# EAGLE design ROV_PWR_4inch (EAGLE 9.2.2)
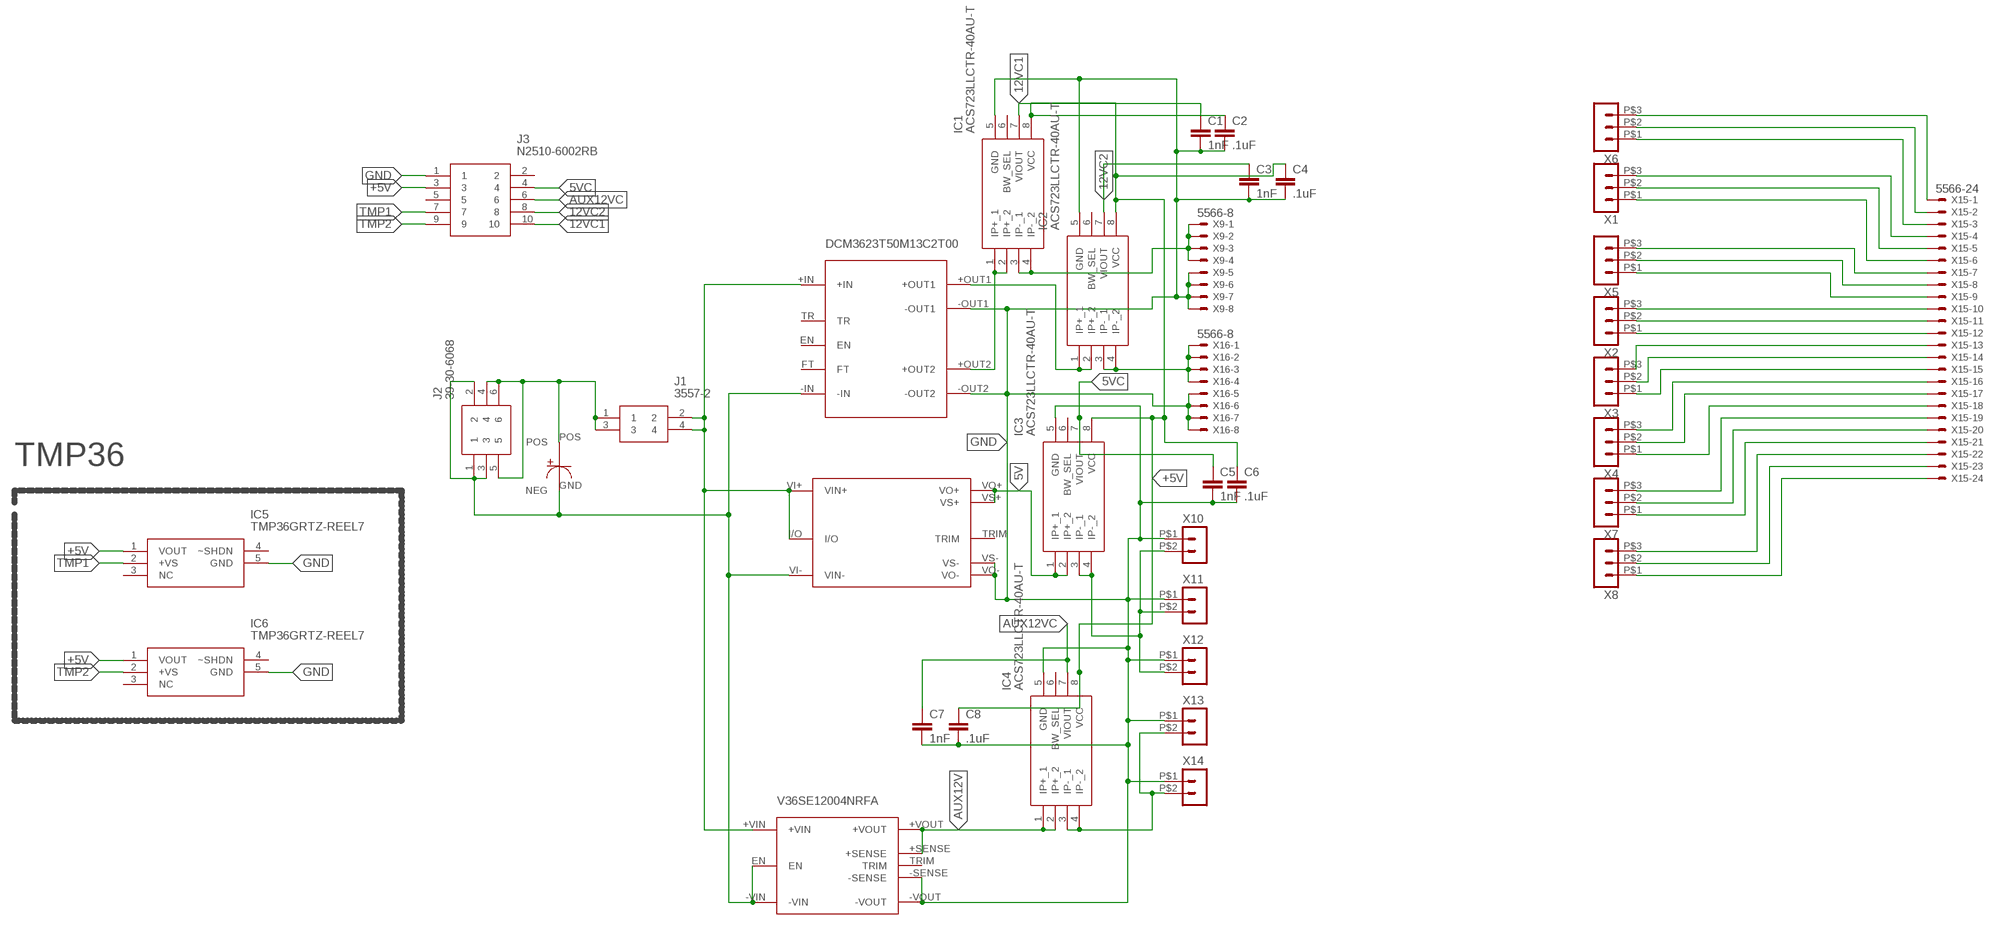
[diagram p0: schematic, sheet 1]

## Parts
C1  1nF  C-EUC0402  [C0402]
C2  .1uF  C-EUC0402  [C0402]
C3  1nF  C-EUC0402  [C0402]
C4  .1uF  C-EUC0402  [C0402]
C5  1nF  C-EUC0402  [C0402]
C6  .1uF  C-EUC0402  [C0402]
C7  1nF  C-EUC0402  [C0402]
C8  .1uF  C-EUC0402  [C0402]
IC1  ACS723LLCTR-40AU-T  [SOT127P600X175-8N]
IC2  ACS723LLCTR-40AU-T  [SOT127P600X175-8N]
IC3  ACS723LLCTR-40AU-T  [SOT127P600X175-8N]
IC4  ACS723LLCTR-40AU-T  [SOT127P600X175-8N]
IC5  TMP36GRTZ-REEL7  [SOT95P280X145-5N]
IC6  TMP36GRTZ-REEL7  [SOT95P280X145-5N]
J1  3557-2  [3557-2]
J2  39-30-6068  [39306068]
J3  N2510-6002RB  [SHDR10W64P254_2X5_2002X859X100]
U$1  DCM3623T50M13C2T00  [DCM3623T50M13C2T00]
U$2  KHHD006A0A41Z  [KHHD006A0A41Z]
U$3  V36SE12004NRFA  [V36SE12004NRFA]
U$4  UBY1V222MHL  [UBY1V222MHL]
X1  HEADER_POS3_43650-0315  [43650-0315]
X2  HEADER_POS3_43650-0315  [43650-0315]
X3  HEADER_POS3_43650-0315  [43650-0315]
X4  HEADER_POS3_43650-0315  [43650-0315]
X5  HEADER_POS3_43650-0315  [43650-0315]
X6  HEADER_POS3_43650-0315  [43650-0315]
X7  HEADER_POS3_43650-0315  [43650-0315]
X8  HEADER_POS3_43650-0315  [43650-0315]
X9  5566-8  [5566-8]
X10  HEADER_POS2_44914-0201  [44914-0201]
X11  HEADER_POS2_44914-0201  [44914-0201]
X12  HEADER_POS2_44914-0201  [44914-0201]
X13  HEADER_POS2_44914-0201  [44914-0201]
X14  HEADER_POS2_44914-0201  [44914-0201]
X15  5566-24  [5566-24]
X16  5566-8  [5566-8]

## Nets
5V: IC3.1(IP+_1) IC3.2(IP+_2) U$2.VO+ U$2.VS+
5VC: C5.1 IC3.7(VIOUT) J3.4
12VC1: C1.1 IC1.7(VIOUT) J3.10
12VC2: C3.1 IC2.7(VIOUT) J3.8
+5V: C2.1 C4.1 C6.1 C8.1 IC1.8(VCC) IC2.8(VCC) IC3.8(VCC) IC4.8(VCC) IC5.1(VOUT) IC6.1(VOUT) J3.3
AUX12V: IC4.1(IP+_1) IC4.2(IP+_2) U$3.+SENSE U$3.+VOUT
AUX12VC: C7.1 IC4.7(VIOUT) J3.6
GND: C1.2 C2.2 C3.2 C4.2 C5.2 C6.2 C7.2 C8.2 IC1.5(GND) IC2.5(GND) IC3.5(GND) IC4.5(GND) IC5.5(GND) IC6.5(GND) J3.1 U$1.-OUT1 U$1.-OUT2 U$2.VO- U$2.VS- U$3.-SENSE U$3.-VOUT X9.5 X9.6 X9.7 X9.8 X10.P$1 X11.P$1 X12.P$1 X13.P$1 X14.P$1 X16.5 X16.6 X16.7 X16.8
N$1: X6.P$3 X15.1
N$2: X6.P$2 X15.2
N$3: X6.P$1 X15.3
N$4: X1.P$3 X15.4
N$5: X1.P$2 X15.5
N$6: X1.P$1 X15.6
N$7: X5.P$3 X15.7
N$8: X5.P$2 X15.8
N$9: X5.P$1 X15.9
N$10: X2.P$3 X15.10
N$11: X2.P$2 X15.11
N$12: X2.P$1 X15.12
N$13: X3.P$3 X15.13
N$14: X3.P$2 X15.14
N$15: X3.P$1 X15.15
N$16: X4.P$3 X15.16
N$17: X4.P$2 X15.17
N$18: X4.P$1 X15.18
N$19: X7.P$3 X15.19
N$20: X7.P$2 X15.20
N$21: X7.P$1 X15.21
N$22: X8.P$3 X15.22
N$23: X8.P$2 X15.23
N$24: X8.P$1 X15.24
N$26: J1.2 J1.4 U$1.+IN U$2.I/O U$2.VI+(VIN+) U$3.+VIN
N$27: IC1.1(IP+_1) IC1.2(IP+_2) U$1.+OUT2
N$28: J2.1 J2.2 J2.3 U$1.-IN U$2.VI-(VIN-) U$3.-VIN U$3.EN U$4.GND(NEG)
N$29: J1.1 J1.3 J2.4 J2.5 J2.6 U$4.POS
N$30: IC3.3(IP-_1) IC3.4(IP-_2) X10.P$2 X11.P$2 X12.P$2
N$31: IC4.3(IP-_1) IC4.4(IP-_2) X13.P$2 X14.P$2
N$32: IC2.1(IP+_1) IC2.2(IP+_2) U$1.+OUT1
N$33: IC2.3(IP-_1) IC2.4(IP-_2) X16.1 X16.2 X16.3 X16.4
N$34: IC1.3(IP-_1) IC1.4(IP-_2) X9.1 X9.2 X9.3 X9.4
TMP1: IC5.2(+VS) J3.7
TMP2: IC6.2(+VS) J3.9
Unconnected: IC1.6(BW_SEL) IC2.6(BW_SEL) IC3.6(BW_SEL) IC4.6(BW_SEL) IC5.3(NC) IC5.4(~SHDN) IC6.3(NC) IC6.4(~SHDN) J3.2 J3.5 U$1.EN U$1.FT U$1.TR U$2.TRIM U$3.TRIM

## Notes on the sheet
- TMP36

## Library data of the parts
C1-C8 = rcl:C-EU: CAPACITOR, European symbol; SPICEPREFIX: C
IC1-IC4 = SamacSys_Parts:ACS723LLCTR-40AU-T: SENSOR CURRENT HALL 40A DC Source: Datasheet <http://www.allegromicro.com/~/media/Files/Datasheets/ACS723-Datasheet.ashx>; DESCRIPTION: SENSOR CURRENT HALL 40A DC; HEIGHT: 1.75mm; MANUFACTURER_NAME: Allegro Microsystems; MANUFACTURER_PART_NUMBER: ACS723LLCTR-40AU-T
IC5 IC6 = SamacSys_Parts:TMP36GRTZ-REEL7: Analog Devices TMP36GRTZ-REEL7 Temperature Sensor 5-Pin SOT-23, -40 +125 C Source: Datasheet <https://componentsearchengine.com/Datasheets/1/TMP36GRTZ-REEL7.pdf>; DESCRIPTION: Analog Devices TMP36GRTZ-REEL7 Temperature Sensor 5-Pin SOT-23, -40 +125 C; HEIGHT: mm; MANUFACTURER_NAME: Analog Devices; MANUFACTURER_PART_NUMBER: TMP36GRTZ-REEL7; MOUSER_PART_NUMBER: 584-TMP36GRTZ-R7
J1 = SamacSys_Parts:3557-2: THM 2 in 1 Auto Blade Holder P/N 3557-2 Source: Datasheet <https://componentsearchengine.com/Datasheets/1/3557-2.pdf>; DESCRIPTION: THM 2 in 1 Auto Blade Holder P/N 3557-2; HEIGHT: mm; MANUFACTURER_NAME: Keystone Electronics; MANUFACTURER_PART_NUMBER: 3557-2; MOUSER_PART_NUMBER: 534-3557-2
J2 = SamacSys_Parts:39-30-6068: Headers & Wire Housings MiniFit Vert Hdr Ass Assy 6Ckt 94V-0 Tin Source: Datasheet <https://componentsearchengine.com/Datasheets/1/39-30-6068.pdf>; DESCRIPTION: Headers & Wire Housings MiniFit Vert Hdr Ass Assy 6Ckt 94V-0 Tin; HEIGHT: 12.8mm; MANUFACTURER_NAME: Molex; MANUFACTURER_PART_NUMBER: 39-30-6068; MOUSER_PART_NUMBER: 538-39-30-6068
J3 = SamacSys_Parts:N2510-6002RB: 3M 10W ST BOX HDR CLASS 2 3M 2500 Series, 2.54mm Pitch 10 Way 2 Row Straight PCB Header, Solder Termination, 2A Source: Datasheet <https://componentsearchengine.com/Datasheets/1/N2510-6002RB.pdf>; DESCRIPTION: 3M 10W ST BOX HDR CLASS 2 3M 2500 Series, 2.54mm Pitch 10 Way 2 Row Straight PCB Header, Solder Termination, 2A; HEIGHT: 10.04mm; MANUFACTURER_NAME: 3M; MANUFACTURER_PART_NUMBER: N2510-6002RB; MOUSER_PART_NUMBER: 517-N2510-6002RB
U$1 = DCM3623T50M13C2T00:DCM3623T50M13C2T00
U$2 = KHHD006A0A41Z:KHHD006A0A41Z
U$3 = V36SE12004NRFA:V36SE12004NRFA
U$4 = UBY1V222MHL:UBY1V222MHL
X1-X8 = con-molex-micro-fit-3_0:HEADER_POS3_?: Molex - Micro-Fit 3.0 Series connector, 3.00mm (0.118") pitch header, 3 positions.
X9 X16 = con-molex:5566-8: Mini FIT connector 8 pol Source: http://www.molex.com; MF: MOLEX; OC_FARNELL: unknown; OC_NEWARK: unknown
X10-X14 = con-molex-micro-fit-3_0:HEADER_POS2_?: Molex - Micro-Fit 3.0 Series connector, 3.00mm (0.118") pitch header, 2 positions.
X15 = con-molex:5566-24: Mini FIT connector 24 pol Source: http://www.molex.com; MF: MOLEX; OC_FARNELL: unknown; OC_NEWARK: unknown

## Board
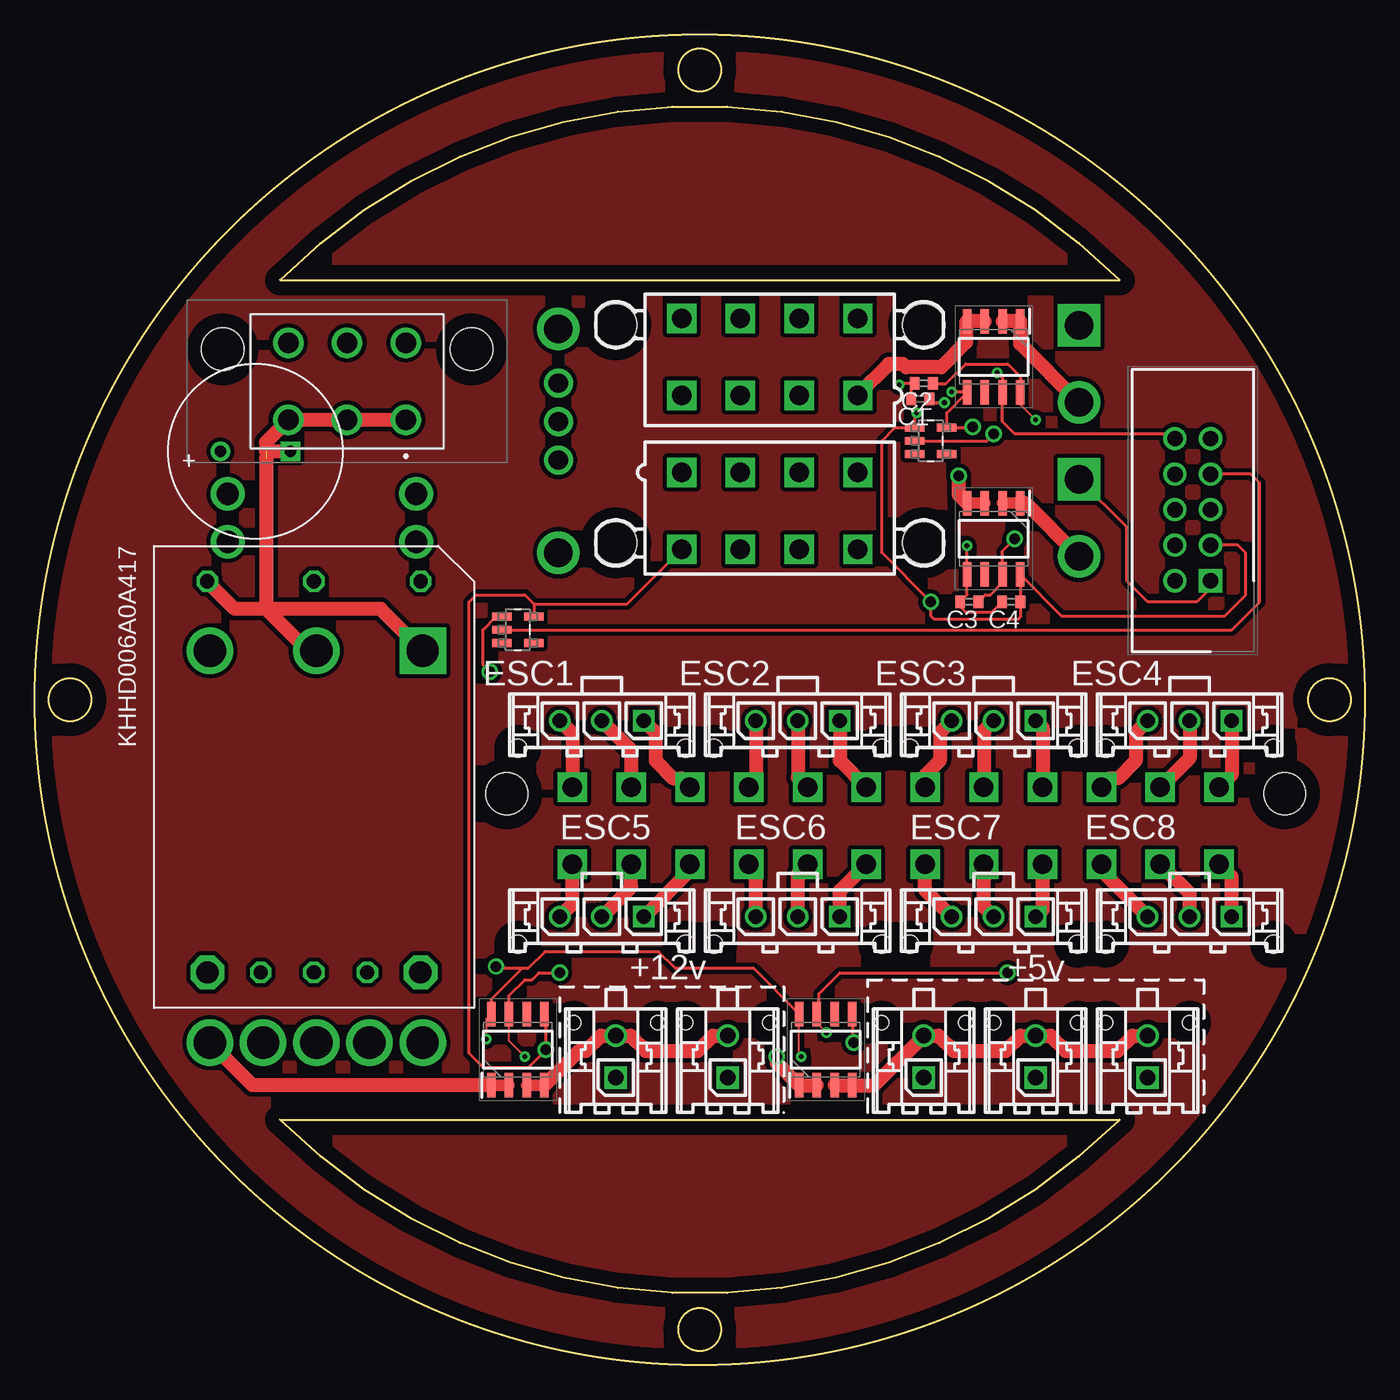
[diagram p1: board, top side]
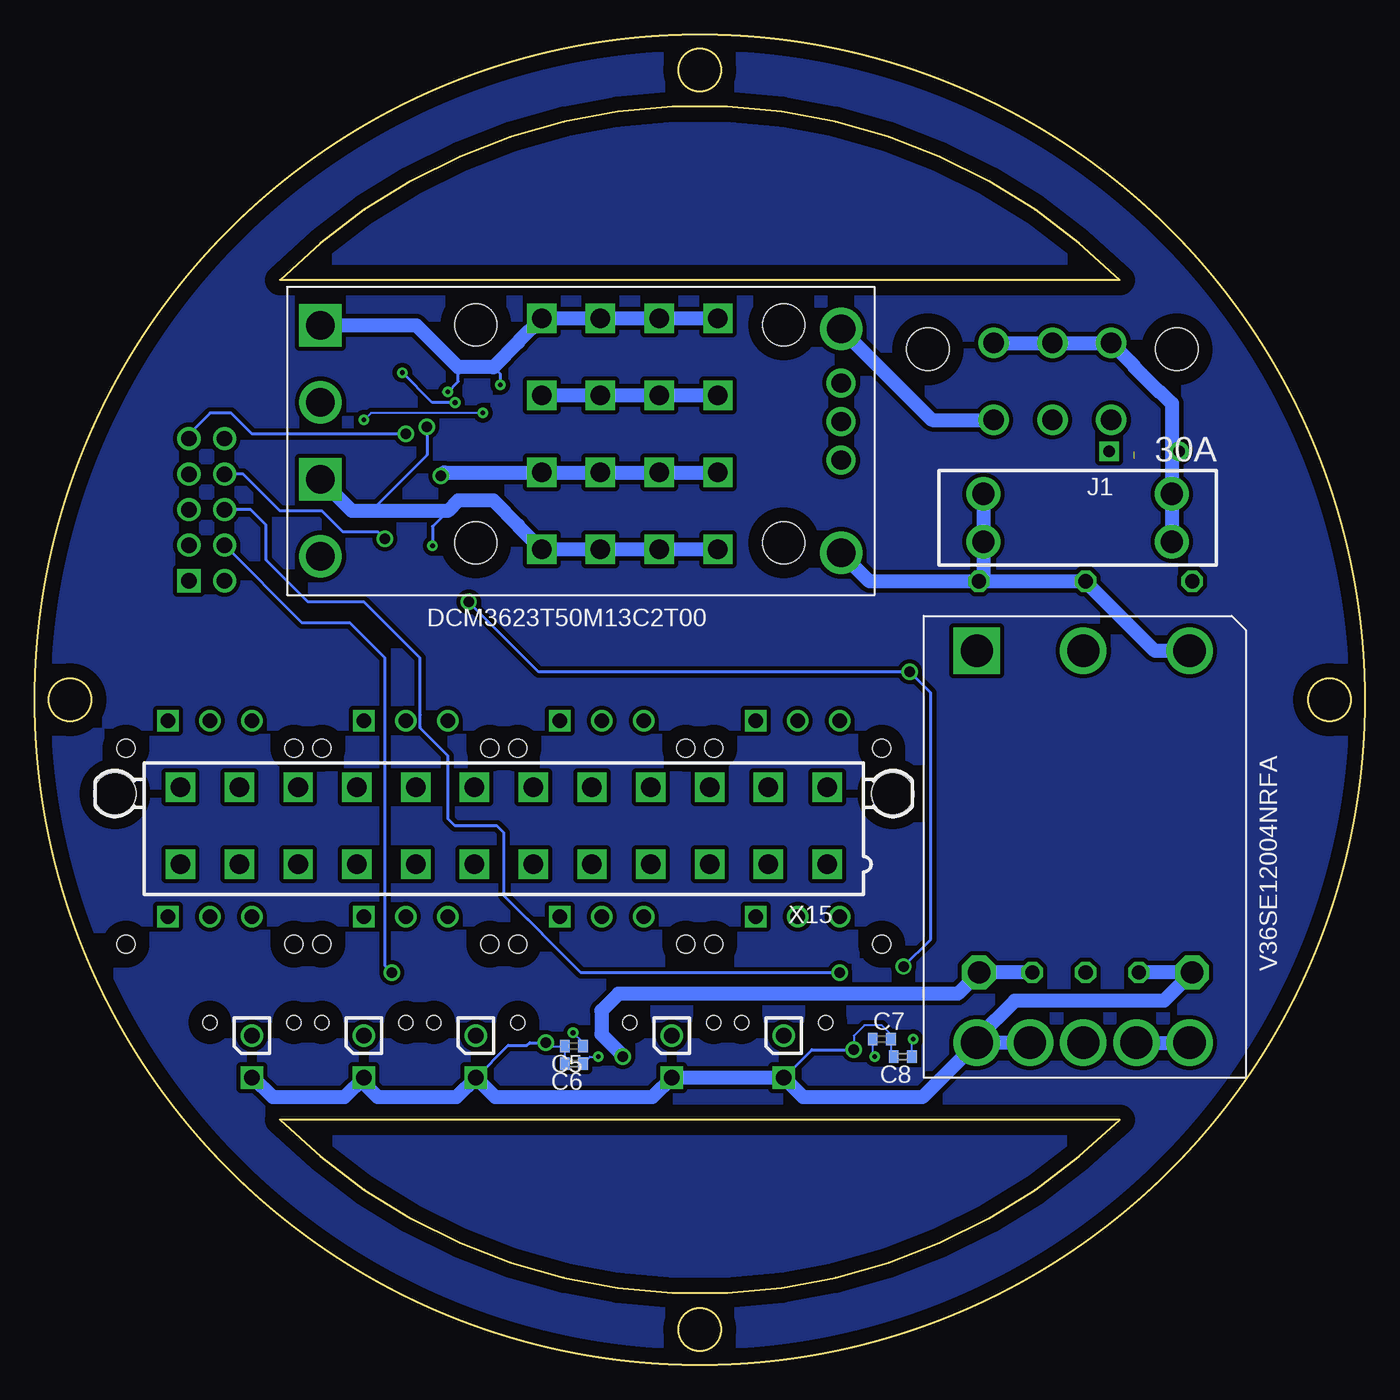
[diagram p2: board, bottom side, seen from below]

Size 95 x 95 mm. Coordinates in mm from the lower left corner, seen from the top.
Outline: 77.5,17.5 arc-90 17.5,17.5 77.5,17.5
Outline: 17.5,77.5 arc-90 77.5,77.5 17.5,77.5
Outline: circle at 47.5,47.5 radius 47.5
Outline: circle at 47.5,92.5 radius 1.5
Outline: circle at 92.5,47.5 radius 1.5
Outline: circle at 47.5,2.5 radius 1.5
Outline: circle at 2.5,47.5 radius 1.5
Copper layers (1*16): Top 0.035mm / dielectric 1.5mm / Bottom 0.035mm
Design rules "default": minimum track width 6mil, minimum drill 0.35mm, track to track 6mil, track to pad 6mil, pad to pad 6mil, via to via 6mil, smd to smd 6mil, copper to edge 40mil, drill to drill 6mil, minimum pad ring 10mil, minimum via ring 8mil, stop-mask expansion 4mil, vias tented up to drill 0mil, thermal gap 10mil

### Footprints (pad centres in the part's own frame; a part is rotated, then mirrored left to right if it is on the bottom)
C0402 = smd 0.7 x 0.9: 1 -0.65,0; 2 0.65,0
SOT127P600X175-8N = smd 1.75 x 0.6: 1 -2.55,1.905; 2 -2.55,0.635; 3 -2.55,-0.635; 4 -2.55,-1.905; 5 2.55,-1.905; 6 2.55,-0.635; 7 2.55,0.635; 8 2.55,1.905
SOT95P280X145-5N = smd 1.372 x 0.559: 1 -1.143,0.94; 2 -1.143,0; 3 -1.143,-0.94; 4 1.143,-0.94; 5 1.143,0.94
3557-2 = drill 1.6 pad 2.4: 1 -6.735,1.7; 2 6.735,1.7; 3 -6.735,-1.7; 4 6.735,-1.7
39306068 = drill 1.45 pad 2.175: 1 0,0; 2 -4.2,0; 3 -8.4,0; 4 0,5.5; 5 -4.2,5.5; 6 -8.4,5.5 | hole 3.05: -13.1,5.04; 4.7,5.04
SHDR10W64P254_2X5_2002X859X100 = drill 1.1 pad 1.65 square: 1 0,0 | drill 1.1 pad 1.65: 2 0,2.54; 3 2.54,0; 4 2.54,2.54; 5 5.08,0; 6 5.08,2.54; 7 7.62,0; 8 7.62,2.54; 9 10.16,0; 10 10.16,2.54
DCM3623T50M13C2T00 = drill 2.03: +IN -18.6,8; +OUT1 18.6,8.25; +OUT2 18.6,-2.75; -IN -18.6,-8 | drill 2.03 square: -OUT1 18.6,2.75; -OUT2 18.6,-8.25 | drill 1.38: EN -18.6,-1.38; FT -18.6,-4.13; TR -18.6,1.38
KHHD006A0A41Z = drill 1.016 octagon: I/O 2.54,11.43; TRIM 30.48,11.43; VI+ 2.54,19.05; VI- 2.54,3.81; VS+ 30.48,15.24; VS- 30.48,7.62 | drill 1.6 octagon: VO+ 30.48,19.05; VO- 30.48,3.81
V36SE12004NRFA = drill 2.3: +SENSE 30.5,15.2; +VIN 2.5,19; +VOUT 30.5,19; -SENSE 30.5,7.6; -VOUT 30.5,3.8; EN 2.5,11.4; TRIM 30.5,11.4 | drill 2.3 square: -VIN 2.5,3.8
UBY1V222MHL = drill 0.85 square: GND -2.5,0 | drill 0.85: POS 2.5,0
43650-0315 = drill 1.02 square: P$1 3,0 | drill 1.02: P$2 0,0; P$3 -3,0 | hole 1.27: 6,-1.96; -6,-1.96
5566-8 = drill 1.4 square: 1 6.3,-2.75; 2 2.1,-2.75; 3 -2.1,-2.75; 4 -6.3,-2.75; 5 6.3,2.75; 6 2.1,2.75; 7 -2.1,2.75; 8 -6.3,2.75 | hole 3: 11,2.29; -11,2.29
44914-0201 = drill 1.09 square: P$1 0,0 | drill 1.09: P$2 0,3 | hole 1.02: 3,3.94; -3,3.94
5566-24 = drill 1.4 square: 1 23.1,-2.75; 2 18.9,-2.75; 3 14.7,-2.75; 4 10.5,-2.75; 5 6.3,-2.75; 6 2.1,-2.75; 7 -2.1,-2.75; 8 -6.3,-2.75; 9 -10.5,-2.75; 10 -14.7,-2.75; 11 -18.9,-2.75; 12 -23.1,-2.75; 13 23.1,2.75; 14 18.9,2.75; 15 14.7,2.75; 16 10.5,2.75; 17 6.3,2.75; 18 2.1,2.75; 19 -2.1,2.75; 20 -6.3,2.75; 21 -10.5,2.75; 22 -14.7,2.75; 23 -18.9,2.75; 24 -23.1,2.75 | hole 3: 27.8,2.29; -27.8,2.29

### Placement (x,y rotation side)
C1  63.25,69 180 top
C2  63.5,70.1 180 top
C3  66.75,54.5 180 top
C4  69.75,54.5 180 top
C5  56.5,22.75 180 bottom
C6  56.5,21.5 180 bottom
C7  34.5,23.25 0 bottom
C8  33,22 180 bottom
IC1  68.5,72 270 top
IC2  68.5,59 270 top
IC3  56.5,22.5 90 top
IC4  34.5,22.5 90 top
IC5  34.5,52.5 0 top
IC6  64,66 0 top
J1  20.5,60.5 180 bottom
J2  26.5,67.5 0 top
J3  84,56 90 top
U$1  56,66 180 bottom
U$2  8.5,58.5 270 top
U$3  31.5,53.5 270 bottom
U$4  15.75,65.25 180 top
X1  54.5,32 0 top
X2  82.5,32 0 top
X3  40.5,46 0 top
X4  54.5,46 0 top
X5  68.5,32 0 top
X6  40.5,32 0 top
X7  68.5,46 0 top
X8  82.5,46 0 top
X9  52.5,72 0 top
X10  79.5,20.5 0 top
X11  71.5,20.5 0 top
X12  63.5,20.5 0 top
X13  49.5,20.5 0 top
X14  41.5,20.5 0 top
X15  61.5,38.5 0 bottom
X16  52.5,61 180 top

### Tracks (layer width: path | path; a pad name or v marks a point on that pad's centre or on a via)
5V  (via drill 0.75)
  Top 1.016: IC3.2 IC3.1 53,21.55 v53,22
  Bottom 1.016: v53,22 53,22.06 54.53,23.6 54.53,25.28 53.32,26.5 29.07,26.5 U$2.VO+ U$2.VS+
5VC  (via drill 0.35, 0.75)
  Top 0.152: v56.55,23.7 55.87,24.39 IC3.7
  Top 0.203: IC3.7 56,25.18 56,26.5 57.5,28 v69.5,28
  Bottom 0.152: C5.1 55.85,23 v56.55,23.7
  Bottom 0.203: v69.5,28 70,28.5 70,50.5 72.5,53 75.92,53 J3.4
12VC1  (via drill 0.35)
  Top 0.2: C1.1 64.17,68.73 v64.98,68.73 | v68.75,70.87 69.14,70.48 IC1.7
  Top 0.203: J3.10 81.34,66.16 81,66.5 70,66.5 69.14,67.36 IC1.7
  Bottom 0.2: v64.98,68.73 66.61,68.73 v68.75,70.87
12VC2  (via drill 0.75)
  Top 0.2: C3.1 67.9,55 68.25,55 69.14,55.88 IC2.7
  Top 0.203: IC2.7 69.14,58.13 v70,59
  Bottom 0.203: v70,59 70.5,59.5 73,59.5 74.5,61 77.5,61 80.12,63.62 J3.8
+5V  (via drill 0.35, 0.75)
  Top 0.152: v54.75,22 54.59,22.16 IC3.8 | v32.25,23.25 32.25,24.7 IC4.8 | v71.5,67.5 70.41,68.59
  Top 0.2: 66.25,53.25 64.26,53.25 64.01,53.5 v64.01,54.5 | C4.1 | C2.1 65.1,70.1 66.5,71.5 69.5,71.5 70.41,70.59 IC1.8
  Top 0.203: IC1.8 70.41,68.59 | v63,68 62.86,67.86 IC6.1 61.44,66.94 60.5,66 60.5,58.01 v64.01,54.5 | 66.25,53.25 70.25,53.25 70.41,53.41 C4.1 IC2.8 73.36,53.5 85,53.5 86.5,55 86.5,58 85.96,58.54 J3.3 | IC3.8 51.36,28.29 45.77,28.29 44.56,29.5 36.44,29.5 35.23,28.29 34.79,28.29 | IC4.8 32.59,26.09 34.79,28.29 | 34.79,28.29 33.1,28.29 v32.94,28.44 | v32.5,49.5 32,50 32,52.5 32.94,53.44 IC5.1
  Bottom 0.152: C6.1 55.35,22 v54.75,22 | C8.1 32.35,23.15 v32.25,23.25 | v63,68 71,68 v71.5,67.5
  Bottom 0.203: v32.94,28.44 31,30.39 31,48 v32.5,49.5 59.01,49.5 v64.01,54.5
AUX12V
  Top 0.813: IC4.1 IC4.2
  Top 1.016: IC4.1 15.55,19.95 U$3.+VOUT
  Bottom 1.016: U$3.+SENSE U$3.+VOUT
AUX12VC  (via drill 0.35, 0.75)
  Top 0.152: v35,22 33.87,23.14 IC4.7
  Top 0.203: IC4.7 33.87,26.36 35,27.5 35.5,27.5 36,28 v37.5,28
  Bottom 0.152: C7.1 35.15,22.15 v35,22
  Bottom 0.203: v37.5,28 56,28 58.75,30.75 58.75,30.77 59.77,31.79 59.79,31.79 61.5,33.5 61.5,38 62,38.5 65,38.5 65.5,39 65.5,43.5 67.5,45.5 67.5,45.56 67.48,45.58 67.48,46.42 67.5,46.44 67.5,50.5 71.5,54.5 75.5,54.5 78.5,57.5 78.5,60 79.58,61.08 J3.6
BOTTOM
  pour Bottom (isolate 0.305): 0.5,47.5 arc-90 47.5,94.5 arc-90 94.5,47.5 arc-90 47.5,0.5 arc-90
GND  (via drill 0.35, 0.75)
  Top 0.2: C4.2 68.35,53.75 66.5,53.75 66.1,54.15 C3.2 66.59,54.99 IC2.5 | C1.2 62.6,69.85 C2.2 61.85,70.1 v61.75,70 | IC2.5 | IC2.5 v66.59,58.5
  Top 0.203: v58.5,23 58.41,23.09 IC3.5 | IC4.5 36.41,25.09 36.5,25 v36.5,22.5 35.25,21.25 32,21.25 31,22.25 31,54.5 31.5,55 35,55 35.64,54.36 | v65.5,69.5 66.55,69.5 IC1.5 65.14,68 IC6.5 66.94,66.94 v67,67 | 35.64,54.36 IC5.5 | 35.64,54.36 42.31,54.36 X16.5 | J3.1 84,55.5 83,54.5 79.5,54.5 78,56 78,59.85 U$1.-OUT1
  Bottom 0.152: v58.5,23 58.25,22.75 C5.2 C6.2 | v36.5,22.5 36.5,23.5 35.75,24.25 34.5,24.25 33.85,23.6 C7.2 33.85,22.2 C8.2 | 65.85,69.5 v65.5,69.5
  Bottom 0.2: v61.75,70 61.75,70.77 62.25,71.27
  Bottom 0.203: v58.5,23 59.64,23 59.83,22.81 61.19,22.81 X12.P$1 | X14.P$1 39.5,22.5 v36.5,22.5 | v65.5,69.5 64.75,70.25 64.75,71.27 | v67,67 67,65 71,61 | 65.49,61 66.59,59.89 v66.59,58.5
  Bottom 1.016: X9.8 X9.7 X9.6 X9.5 60.48,73.07 60.48,73.04 62.25,71.27 64.75,71.27 67.74,74.25 U$1.-OUT2 | X16.5 X16.6 X16.7 X16.8 60.48,59.93 60.48,59.96 62.25,61.73 64.75,61.73 65.49,61 71,61 72.35,61 U$1.-OUT1 | 27.7,23.3 25,26 14.33,26 U$2.VO- U$2.VS- | 27.7,23.3 U$3.-VOUT 31.6,19.1 40.1,19.1 X14.P$1 X13.P$1 50.9,19.1 62.1,19.1 X12.P$1 64.9,19.1 70.5,19.1 71.5,20.1 X11.P$1 72.9,19.1 78,19.1 79.4,20.5 X10.P$1 | U$3.-SENSE 27.4,23 27.7,23.3
N$1
  Top 1.016: X6.P$3 38.4,32.9 X15.1
N$2
  Top 1.016: X6.P$2 42.6,34.1 X15.2
N$3
  Top 1.016: X6.P$1 46.8,35.3 X15.3
N$4
  Top 1.016: X1.P$3 51.5,35.25 X15.4
N$5
  Top 1.016: X1.P$2 54.5,35.05 X15.5
N$6
  Top 1.016: X1.P$1 57.5,33.85 X15.6
N$7
  Top 1.016: X5.P$3 63.6,33.9 X15.7
N$8
  Top 1.016: X5.P$2 67.8,32.7 X15.8
N$9
  Top 1.016: X5.P$1 72,32.5 X15.9
N$10
  Top 1.016: X2.P$3 76.2,35.3 X15.10
N$11
  Top 1.016: X2.P$2 82.5,33.65 X15.11
N$12
  Top 1.016: X2.P$1 85.5,34.85 X15.12
N$13
  Top 1.016: X3.P$3 38.4,45.1 X15.13
N$14
  Top 1.016: X3.P$2 42.6,43.9 X15.14
N$15
  Top 1.016: X3.P$1 44.34,45.16 44.34,43.15 45.61,41.88 46.17,41.88 X15.15
N$16
  Top 1.016: X4.P$3 51.5,41.75 X15.16
N$17
  Top 1.016: X4.P$2 54.5,41.95 X15.17
N$18
  Top 1.016: X4.P$1 57.5,43.15 X15.18
N$19
  Top 1.016: X15.19 63.6,42.09 64.66,43.15 64.66,45.16 X7.P$3
N$20
  Top 1.016: X7.P$2 67.8,45.3 X15.20
N$21
  Top 1.016: X7.P$1 72,45.5 X15.21
N$22
  Top 1.016: X8.P$3 78.66,45.16 78.66,43.15 77.39,41.88 76.83,41.88 X15.22
N$23
  Top 1.016: X8.P$2 82.5,43.35 X15.23
N$24
  Top 1.016: X8.P$1 85.5,42.15 X15.24
N$26
  Bottom 1.016: J1.4 J1.2 27.23,56.27 U$2.VI+ | U$3.+VIN 14.97,51 U$2.I/O U$2.VI+ | U$2.VI+ 35.36,55.96 U$1.+IN
N$27
  Top 1.016: U$1.+OUT2 70.41,72.94 IC1.1 IC1.2
N$28  (1 unrouted)
  Top 1.016: U$3.-VIN 24.7,54 16.5,54 | U$2.VI- 14.27,54 16.5,54 | 16.5,64.75 16.5,54 | U$3.EN 19.5,51 16.5,54 | J2.1 J2.2 J2.3 16.5,65.9 16.5,65.25 U$4.GND
  Bottom 1.016: U$1.-IN 30.9,67.5 J2.1
N$29
  Bottom 1.016: J2.4 J2.5 J2.6 16.45,71.35 16.45,71.28 14.66,69.49 14.59,69.49 13.77,68.66 J1.3 | J1.3 J1.1 | U$4.POS 13.77,64.73 J1.3
N$30
  Top 1.016: IC3.3 IC3.4 59.95,19.95 X12.P$2 64.56,23.5 65.66,22.41 69.34,22.41 70.44,23.5 X11.P$2 72.56,23.5 73.66,22.41 77.34,22.41 78.44,23.5 X10.P$2
N$31
  Top 0.813: IC4.3 IC4.4
  Top 1.016: X13.P$2 48.44,23.5 47.34,22.41 43.66,22.41 42.56,23.5 X14.P$2 40.44,23.5 39.34,22.41 38.86,22.41 IC4.4
N$32
  Top 0.813: IC2.1 IC2.2
  Top 1.016: U$1.+OUT1 70.8,61.55 IC2.1
N$33  (via drill 0.75)
  Top 0.813: IC2.3 IC2.4
  Top 1.016: IC2.4 66,62.14 v66,63.5
  Bottom 1.016: v66,63.5 65.75,63.75 X16.4 X16.3 X16.2 X16.1
N$34
  Top 1.016: IC1.3 IC1.4 66.52,74.48 66.52,73.04 64.75,71.27 62.25,71.27 62.01,71.5 61,71.5 58.8,69.3 X9.1
  Bottom 1.016: X9.4 X9.3 X9.2 X9.1
TMP1
  Top 0.203: J3.7 86.88,63.62 87.5,63 87.5,54.5 85.5,52.5 IC5.2
TMP2  (via drill 0.75)
  Top 0.203: IC6.2 68,66 v68.5,66.5
  Bottom 0.203: v68.5,66.5 79.5,66.5 81,68 82.5,68 84,66.5 J3.9
TOP
  pour Top (isolate 0.305): 0.5,47.5 arc-90 47.5,94.5 arc-90 94.5,47.5 arc-90 47.5,0.5 arc-90

### Text on the board
tNames: ESC1 | ESC2 | ESC3 | ESC4 | ESC5 | ESC6 | ESC7 | ESC8 | +12v | +5v
bNames: 30A